# EAGLE design nixie-clock (EAGLE 9.1.0)
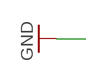
[diagram p0: schematic, sheet 1, part 1 of 2]
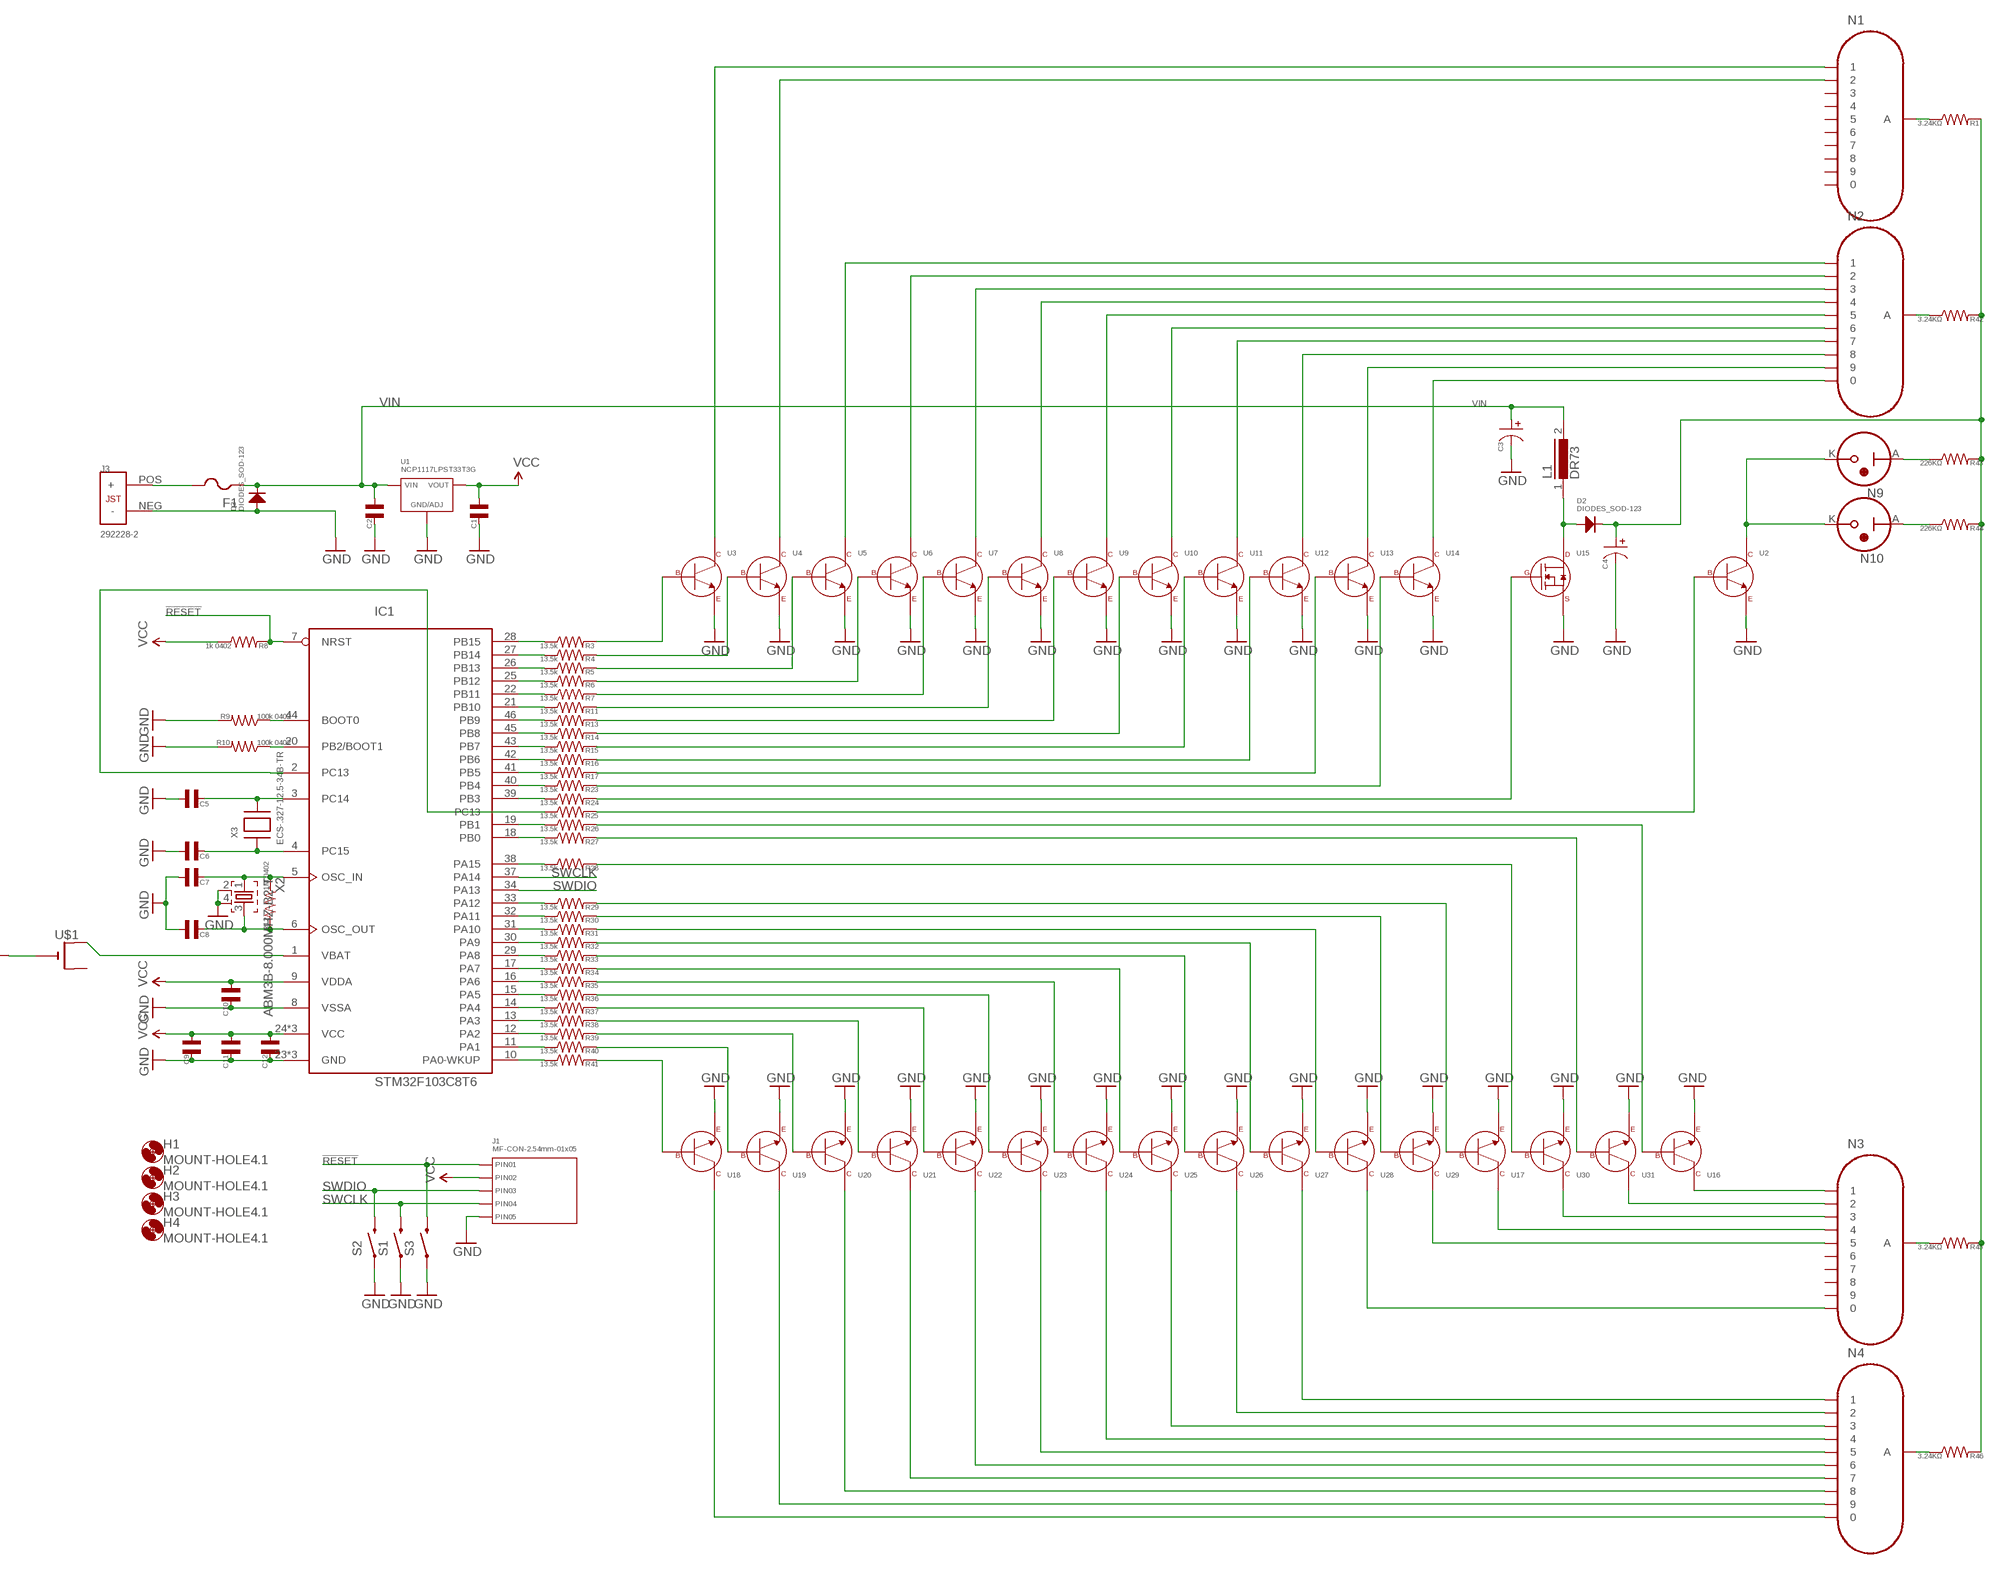
[diagram p1: schematic, sheet 1, part 2 of 2]

## Parts
C1  CAPACITOR_NP_1206  [C1206]
C2  CAPACITOR_NP_1206  [C1206]
C3  CAPACITOR_P_6.3MM  [CP6.3MM]
C4  CAPACITOR_P_6.3MM  [CP6.3MM]
C5  CAPACITOR_NP_0402  [C0402]
C6  CAPACITOR_NP_0402  [C0402]
C7  CAPACITOR_NP_0402  [C0402]
C8  CAPACITOR_NP_0402  [C0402]
C9  CAPACITOR_NP_0402  [C0402]
C10  CAPACITOR_NP_0402  [C0402]
C11  CAPACITOR_NP_0402  [C0402]
C12  CAPACITOR_NP_0402  [C0402]
D2  DIODES_SOD-123  [SOD-123]
D3  DIODES_SOD-123  [SOD-123]
F1  PTCFUSE-1812  [1812]
H1  MOUNT-HOLE4.1  [4,1]
H2  MOUNT-HOLE4.1  [4,1]
H3  MOUNT-HOLE4.1  [4,1]
H4  MOUNT-HOLE4.1  [4,1]
IC1  STM32F103C8T6  STM32F103C8T  [LQFP48]
J1  MF-CON-2.54mm-01x05  CON_01X05_PTH_2.54MM  [PTH_2.54MM_01X05]
J3  292228-2  MINICT  [292228-2]
L1  DR73  [DR73]
N1  Hour1  IN-4  [IN-4]
N2  Hour2  IN-4  [IN-4]
N3  Minutes1  IN-4  [IN-4]
N4  Minutes2  IN-4  [IN-4]
N9  RainyBulb  INS-1  [INS-1]
N10  SnowyBulb  INS-1  [INS-1]
R1  3.24KΩ  RESISTOR_0402  [R0402]
R3  13.5k  RESISTOR_0402  [R0402]
R4  13.5k  RESISTOR_0402  [R0402]
R5  13.5k  RESISTOR_0402  [R0402]
R6  13.5k  RESISTOR_0402  [R0402]
R7  13.5k  RESISTOR_0402  [R0402]
R8  1k 0402  RESISTOR_0402  [R0402]
R9  100k 0402  RESISTOR_0402  [R0402]
R10  100k 0402  RESISTOR_0402  [R0402]
R11  13.5k  RESISTOR_0402  [R0402]
R12  1M 0402  RESISTOR_0402  [R0402]
R13  13.5k  RESISTOR_0402  [R0402]
R14  13.5k  RESISTOR_0402  [R0402]
R15  13.5k  RESISTOR_0402  [R0402]
R16  13.5k  RESISTOR_0402  [R0402]
R17  13.5k  RESISTOR_0402  [R0402]
R23  13.5k  RESISTOR_0402  [R0402]
R24  13.5k  RESISTOR_0402  [R0402]
R25  13.5k  RESISTOR_0402  [R0402]
R26  13.5k  RESISTOR_0402  [R0402]
R27  13.5k  RESISTOR_0402  [R0402]
R28  13.5k  RESISTOR_0402  [R0402]
R29  13.5k  RESISTOR_0402  [R0402]
R30  13.5k  RESISTOR_0402  [R0402]
R31  13.5k  RESISTOR_0402  [R0402]
R32  13.5k  RESISTOR_0402  [R0402]
R33  13.5k  RESISTOR_0402  [R0402]
R34  13.5k  RESISTOR_0402  [R0402]
R35  13.5k  RESISTOR_0402  [R0402]
R36  13.5k  RESISTOR_0402  [R0402]
R37  13.5k  RESISTOR_0402  [R0402]
R38  13.5k  RESISTOR_0402  [R0402]
R39  13.5k  RESISTOR_0402  [R0402]
R40  13.5k  RESISTOR_0402  [R0402]
R41  13.5k  RESISTOR_0402  [R0402]
R42  3.24KΩ  RESISTOR_0402  [R0402]
R43  226KΩ  RESISTOR_0402  [R0402]
R44  226KΩ  RESISTOR_0402  [R0402]
R45  3.24KΩ  RESISTOR_0402  [R0402]
R46  3.24KΩ  RESISTOR_0402  [R0402]
S1  SWITCH-MOMENTARY-2TACTILE-SWITCH-SMD-RIGHT-ANGLE  [TACTILE_SWITCH-SMD-RIGHT-ANGLE]
S2  SWITCH-MOMENTARY-2TACTILE-SWITCH-SMD-RIGHT-ANGLE  [TACTILE_SWITCH-SMD-RIGHT-ANGLE]
S3  SWITCH-MOMENTARY-2TACTILE-SWITCH-SMD-RIGHT-ANGLE  [TACTILE_SWITCH-SMD-RIGHT-ANGLE]
U1  NCP1117LPST33T3G  [SOT-223-3]
U2  NPN_BJT_SOT-23-3  [SOT-23-3]
U3  NPN_BJT_SOT-23-3  [SOT-23-3]
U4  NPN_BJT_SOT-23-3  [SOT-23-3]
U5  NPN_BJT_SOT-23-3  [SOT-23-3]
U6  NPN_BJT_SOT-23-3  [SOT-23-3]
U7  NPN_BJT_SOT-23-3  [SOT-23-3]
U8  NPN_BJT_SOT-23-3  [SOT-23-3]
U9  NPN_BJT_SOT-23-3  [SOT-23-3]
U10  NPN_BJT_SOT-23-3  [SOT-23-3]
U11  NPN_BJT_SOT-23-3  [SOT-23-3]
U12  NPN_BJT_SOT-23-3  [SOT-23-3]
U13  NPN_BJT_SOT-23-3  [SOT-23-3]
U14  NPN_BJT_SOT-23-3  [SOT-23-3]
U15  N-CHANNEL_FET_TO-252-3  [TO-252-3]
U16  NPN_BJT_SOT-23-3  [SOT-23-3]
U17  NPN_BJT_SOT-23-3  [SOT-23-3]
U18  NPN_BJT_SOT-23-3  [SOT-23-3]
U19  NPN_BJT_SOT-23-3  [SOT-23-3]
U20  NPN_BJT_SOT-23-3  [SOT-23-3]
U21  NPN_BJT_SOT-23-3  [SOT-23-3]
U22  NPN_BJT_SOT-23-3  [SOT-23-3]
U23  NPN_BJT_SOT-23-3  [SOT-23-3]
U24  NPN_BJT_SOT-23-3  [SOT-23-3]
U25  NPN_BJT_SOT-23-3  [SOT-23-3]
U26  NPN_BJT_SOT-23-3  [SOT-23-3]
U27  NPN_BJT_SOT-23-3  [SOT-23-3]
U28  NPN_BJT_SOT-23-3  [SOT-23-3]
U29  NPN_BJT_SOT-23-3  [SOT-23-3]
U30  NPN_BJT_SOT-23-3  [SOT-23-3]
U31  NPN_BJT_SOT-23-3  [SOT-23-3]
U$1  CR1220SMT  [CR1220-SMD]
X2  ABM3B-8.000MHZ-B2-T  CRYSTALS-GND-LID-CFPX-104  [5.2X3.4-4-PAD]
X3  ECS-.327-12.5-34B-TR  XTAL-3.2X1.5  [XTAL3215]

## Nets
!RESET: IC1.7(NRST) J1.P$1(PIN1) R8.P$2 S3.2
GND [Power]: C1.P$2 C2.P$2 C3.P$2 C4.P$2 C5.P$1 C6.P$1 C7.P$1 C8.P$1 C9.P$2 C10.P$2 C11.P$2 C12.P$2 D3.ANODE IC1.8(VSSA) IC1.23(GND) IC1.35(GND) IC1.47(GND) J1.P$5(PIN5) J3.NEG(-) R9.P$2 R10.P$2 S1.1 S2.1 S3.1 U1.P$2(GND/ADJ) U2.P$2(EMITTER) U3.P$2(EMITTER) U4.P$2(EMITTER) U5.P$2(EMITTER) U6.P$2(EMITTER) U7.P$2(EMITTER) U8.P$2(EMITTER) U9.P$2(EMITTER) U10.P$2(EMITTER) U11.P$2(EMITTER) U12.P$2(EMITTER) U13.P$2(EMITTER) U14.P$2(EMITTER) U15.2(SOURCE) U16.P$2(EMITTER) U17.P$2(EMITTER) U18.P$2(EMITTER) U19.P$2(EMITTER) U20.P$2(EMITTER) U21.P$2(EMITTER) U22.P$2(EMITTER) U23.P$2(EMITTER) U24.P$2(EMITTER) U25.P$2(EMITTER) U26.P$2(EMITTER) U27.P$2(EMITTER) U28.P$2(EMITTER) U29.P$2(EMITTER) U30.P$2(EMITTER) U31.P$2(EMITTER) U$1.- X2.2 X2.4
HV [Power]: C4.P$1 D2.CATHODE R1.P$2 R42.P$2 R43.P$2 R44.P$2 R45.P$2 R46.P$2
HV1 [Power]: N1.4(A) R1.P$1
HV2 [Power]: N2.4(A) R42.P$1
HV3 [Power]: N3.4(A) R45.P$1
HV4 [Power]: N4.4(A) R46.P$1
N$1: IC1.28(PB15) R3.P$1
N$2: IC1.27(PB14) R4.P$1
N$3: IC1.26(PB13) R5.P$1
N$4: IC1.25(PB12) R6.P$1
N$5: IC1.22(PB11) R7.P$1
N$6: IC1.21(PB10) R11.P$1
N$7: IC1.46(PB9) R13.P$1
N$8: IC1.45(PB8) R14.P$1
N$9: IC1.43(PB7) R15.P$1
N$10: IC1.42(PB6) R16.P$1
N$11: IC1.41(PB5) R17.P$1
N$12: IC1.40(PB4) R23.P$1
N$13: IC1.39(PB3) R24.P$1
N$14: IC1.19(PB1) R26.P$1
N$15: IC1.18(PB0) R27.P$1
N$16: IC1.38(PA15) R28.P$1
N$17: IC1.33(PA12) R29.P$1
N$18: IC1.32(PA11) R30.P$1
N$19: IC1.31(PA10) R31.P$1
N$20: IC1.30(PA9) R32.P$1
N$21: IC1.29(PA8) R33.P$1
N$22: IC1.17(PA7) R34.P$1
N$23: IC1.16(PA6) R35.P$1
N$24: IC1.15(PA5) R36.P$1
N$25: IC1.14(PA4) R37.P$1
N$26: IC1.13(PA3) R38.P$1
N$27: IC1.12(PA2) R39.P$1
N$28: IC1.11(PA1) R40.P$1
N$29: IC1.10(PA0-WKUP) R41.P$1
N$30: R3.P$2 U3.P$1(BASE)
N$31: IC1.20(PB2/BOOT1) R10.P$1
N$32: IC1.44(BOOT0) R9.P$1
N$33: D2.ANODE L1.1 U15.PAD(DRAIN)
N$34: N9.A R43.P$1
N$35: N10.A R44.P$1
N$36: C5.P$2 IC1.3(PC14) X3.P$2
N$37: C6.P$2 IC1.4(PC15) X3.P$1
N$38: C7.P$2 IC1.5(OSC_IN) R12.P$1 X2.1
N$39: C8.P$2 IC1.6(OSC_OUT) R12.P$2 X2.3
N$42: R4.P$2 U4.P$1(BASE)
N$43: IC1.1(VBAT) U$1.+$1(+)
N$44: R5.P$2 U5.P$1(BASE)
N$45: R6.P$2 U6.P$1(BASE)
N$46: R7.P$2 U7.P$1(BASE)
N$47: R11.P$2 U8.P$1(BASE)
N$48: N1.14 U3.P$3(COLLECTOR)
N$49: N1.9 U4.P$3(COLLECTOR)
N$50: N2.14 U5.P$3(COLLECTOR)
N$51: N2.9 U6.P$3(COLLECTOR)
N$52: N2.11 U7.P$3(COLLECTOR)
N$53: N2.1 U8.P$3(COLLECTOR)
N$54: N2.12 U9.P$3(COLLECTOR)
N$55: N2.2 U10.P$3(COLLECTOR)
N$56: N2.6 U11.P$3(COLLECTOR)
N$57: R13.P$2 U9.P$1(BASE)
N$58: R14.P$2 U10.P$1(BASE)
N$59: R15.P$2 U11.P$1(BASE)
N$60: N2.3 U12.P$3(COLLECTOR)
N$61: N2.5 U13.P$3(COLLECTOR)
N$62: N2.8 U14.P$3(COLLECTOR)
N$63: R16.P$2 U12.P$1(BASE)
N$64: R17.P$2 U13.P$1(BASE)
N$65: R23.P$2 U14.P$1(BASE)
N$66: R24.P$2 U15.1(GATE)
N$67: R25.P$2 U2.P$1(BASE)
N$68: R26.P$2 U16.P$1(BASE)
N$69: F1.2 J3.POS(+)
N$70: N9.K N10.K U2.P$3(COLLECTOR)
N$71: N3.14 U16.P$3(COLLECTOR)
N$72: R41.P$2 U18.P$1(BASE)
N$73: R40.P$2 U19.P$1(BASE)
N$74: R39.P$2 U20.P$1(BASE)
N$75: R38.P$2 U21.P$1(BASE)
N$76: R37.P$2 U22.P$1(BASE)
N$77: R36.P$2 U23.P$1(BASE)
N$78: R35.P$2 U24.P$1(BASE)
N$79: R34.P$2 U25.P$1(BASE)
N$80: R33.P$2 U26.P$1(BASE)
N$81: R32.P$2 U27.P$1(BASE)
N$82: R31.P$2 U28.P$1(BASE)
N$83: R30.P$2 U29.P$1(BASE)
N$84: R29.P$2 U17.P$1(BASE)
N$85: R28.P$2 U30.P$1(BASE)
N$86: R27.P$2 U31.P$1(BASE)
N$87: N3.9 U31.P$3(COLLECTOR)
N$88: N3.11 U30.P$3(COLLECTOR)
N$89: N3.1 U17.P$3(COLLECTOR)
N$90: N3.12 U29.P$3(COLLECTOR)
N$91: N3.8 U28.P$3(COLLECTOR)
N$92: N4.14 U27.P$3(COLLECTOR)
N$93: N4.9 U26.P$3(COLLECTOR)
N$94: N4.11 U25.P$3(COLLECTOR)
N$95: N4.1 U24.P$3(COLLECTOR)
N$96: N4.12 U23.P$3(COLLECTOR)
N$97: N4.2 U22.P$3(COLLECTOR)
N$98: N4.6 U21.P$3(COLLECTOR)
N$99: N4.3 U20.P$3(COLLECTOR)
N$100: N4.5 U19.P$3(COLLECTOR)
N$101: N4.8 U18.P$3(COLLECTOR)
PC13: IC1.2(PC13) R25.P$1
SWCLK: IC1.37(PA14) J1.P$4(PIN4) S1.2
SWDIO: IC1.34(PA13) J1.P$3(PIN3) S2.2
VCC [Power]: C1.P$1 C9.P$1 C10.P$1 C11.P$1 C12.P$1 IC1.9(VDDA) IC1.24(VCC) IC1.36(VCC) IC1.48(VCC) J1.P$2(PIN2) R8.P$1 U1.P$1(VOUT) U1.P$3(VOUT)
VIN [thicc]: C2.P$1 C3.P$1 D3.CATHODE F1.1 L1.2 U1.P$4(VIN)
Unconnected: N1.1 N1.2 N1.3 N1.5 N1.6 N1.8 N1.11 N1.12 N3.2 N3.3 N3.5 N3.6 U$1.+$2(+1)

## Library data of the parts
C1 C2 C5-C12 = MF_Passives:CAPACITOR_NP: Library: MF_Passives Description: Device for Non-Polarized Capacitors. Manufacture part number (MPN) can be added via Attributes. Check https://factory.macrofab.com/parts for the house parts list.; POPULATE: 1
C3 C4 = MF_Passives:CAPACITOR_P: Library: MF_Passives Description: Device for Polarized Capacitors. Manufacture part number (MPN), Voltage Rating, and Tolerance can be added via Attributes. Check https://factory.macrofab.com/parts for the house parts list.; POPULATE: 1
D2 D3 = MF_Discrete_Semiconductor:DIODES: Library: MF_Discrete_Semiconductor Description: Device for Single Packaged Diodes.; HOUSEPART: NO; POPULATE: 1
F1 = adafruit:PTCFUSE: PTC fuses, resettable thermistors
H1-H4 = holes:MOUNT-HOLE: MOUNTING HOLE with drill center marker
IC1 = micro-stm_v2:STM32F103C*T: ARM 32-bit Cortex™-M3 CPU 72 MHz maximum frequency 16 to 128 Kbytes of Flash memory 6 to 20 kbytes of SRAM 37 GPIOs 2.0 to 3.6 V application supply
J1 = MF_Connectors:CON_01X05: Library: MF_Connectors Description: Header Connector with 5 Positions and 01 Rows. Use the LABEL Attribute to label the pin on the schematic and PCB. You can remove the attributes on the PCB by using the SMASH function on the part and then deleting the text.; HOUSEPART: YES; MPN: MF-CON-2.54mm-01x05; POPULATE: 1; URL: https://factory.macrofab.com/part/MF-CON-2.54mm-01x05
J3 = sonik:MINICT
L1 = inductors:DR73: High Power Density, High Efficiency, Shielded Inductors Source: coiltronics_dr_series.pdf; SPICEPREFIX: L
N1-N4 = russian-nixies:IN-4: IN-4: large numeric topview nixie tube
N9 N10 = russian-nixies:INS-1
R1 R3-R17 R23-R46 = MF_Passives:RESISTOR: Library: MF_Passives Description: Device for Resistors. Manufacture part number (MPN), Voltage, Tolerance, and Wattage Rating can be added via Attributes. Check https://factory.macrofab.com/parts for the house parts list.; POPULATE: 1
S1-S3 = sonik:SWITCH-MOMENTARY-2: Various NO switches- pushbuttons, reed, etc; PROD_ID: COMP-12265
U1 = MF_IC_Power:NCP1117LP: Manufacturer Part #: NCP1117LP Manufacturer: ON Semiconductor Description: LDO Voltage Regulators; HOUSEPART: NO; MPN: NCP1117LPST33T3G; POPULATE: 1; URL: http://www.onsemi.com/pub_link/Collateral/NCP1117LP-D.PDF
U2-U14 U16-U31 = MF_Discrete_Semiconductor:NPN_BJT: Library: MF_Discrete_Semiconductor Description: Device for Single NPN BJT Transistors. Manufacture part number (MFG#) can be added via Attributes.; HOUSEPART: NO; POPULATE: 1
U15 = MF_Discrete_Semiconductor:N-CHANNEL_FET: Library: MF_Discrete_Semiconductor Description: Device for Single N-Channel Mosfet. Manufacture part number (MFG#) can be added via Attributes.; HOUSEPART: NO; POPULATE: 1
U$1 = adafruit:CR1220: CR1216/CR1220/CR1225 12mm 3V lithium coin cell Great for battery packup. Both SMT and THM holders. Note the THM package has the ground pads on both sides of the PCB so that the masks are the same - this reduces the cost
X2 = IQD-Frequency-Products:CRYSTALS-GND-LID: CRYSTALS WITH CAN GROUNDED
X3 = adafruit:XTAL: Low cost SMT crystals, no capacitors included http://www.ladyada.net/library/eagle

## Net classes
1 Power: width 0.305 mm
2 thicc: width 0.61 mm

## Board
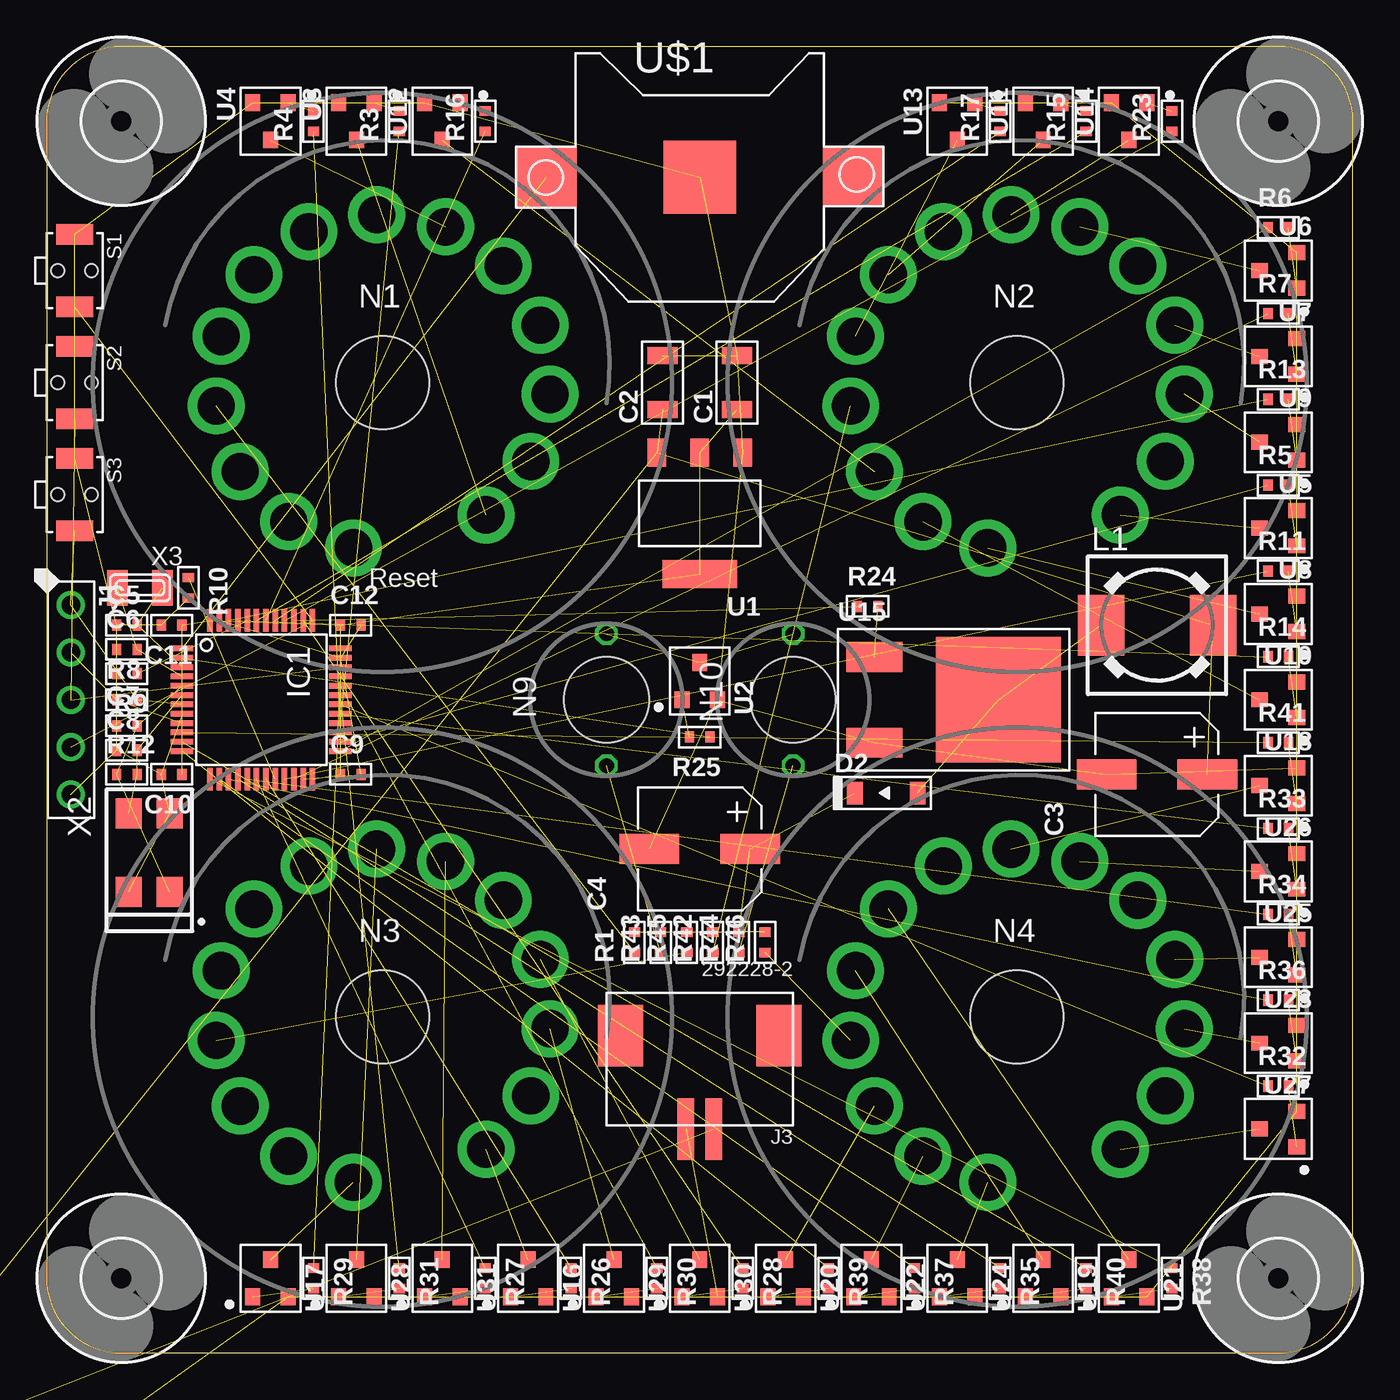
[diagram p2: board, top side]
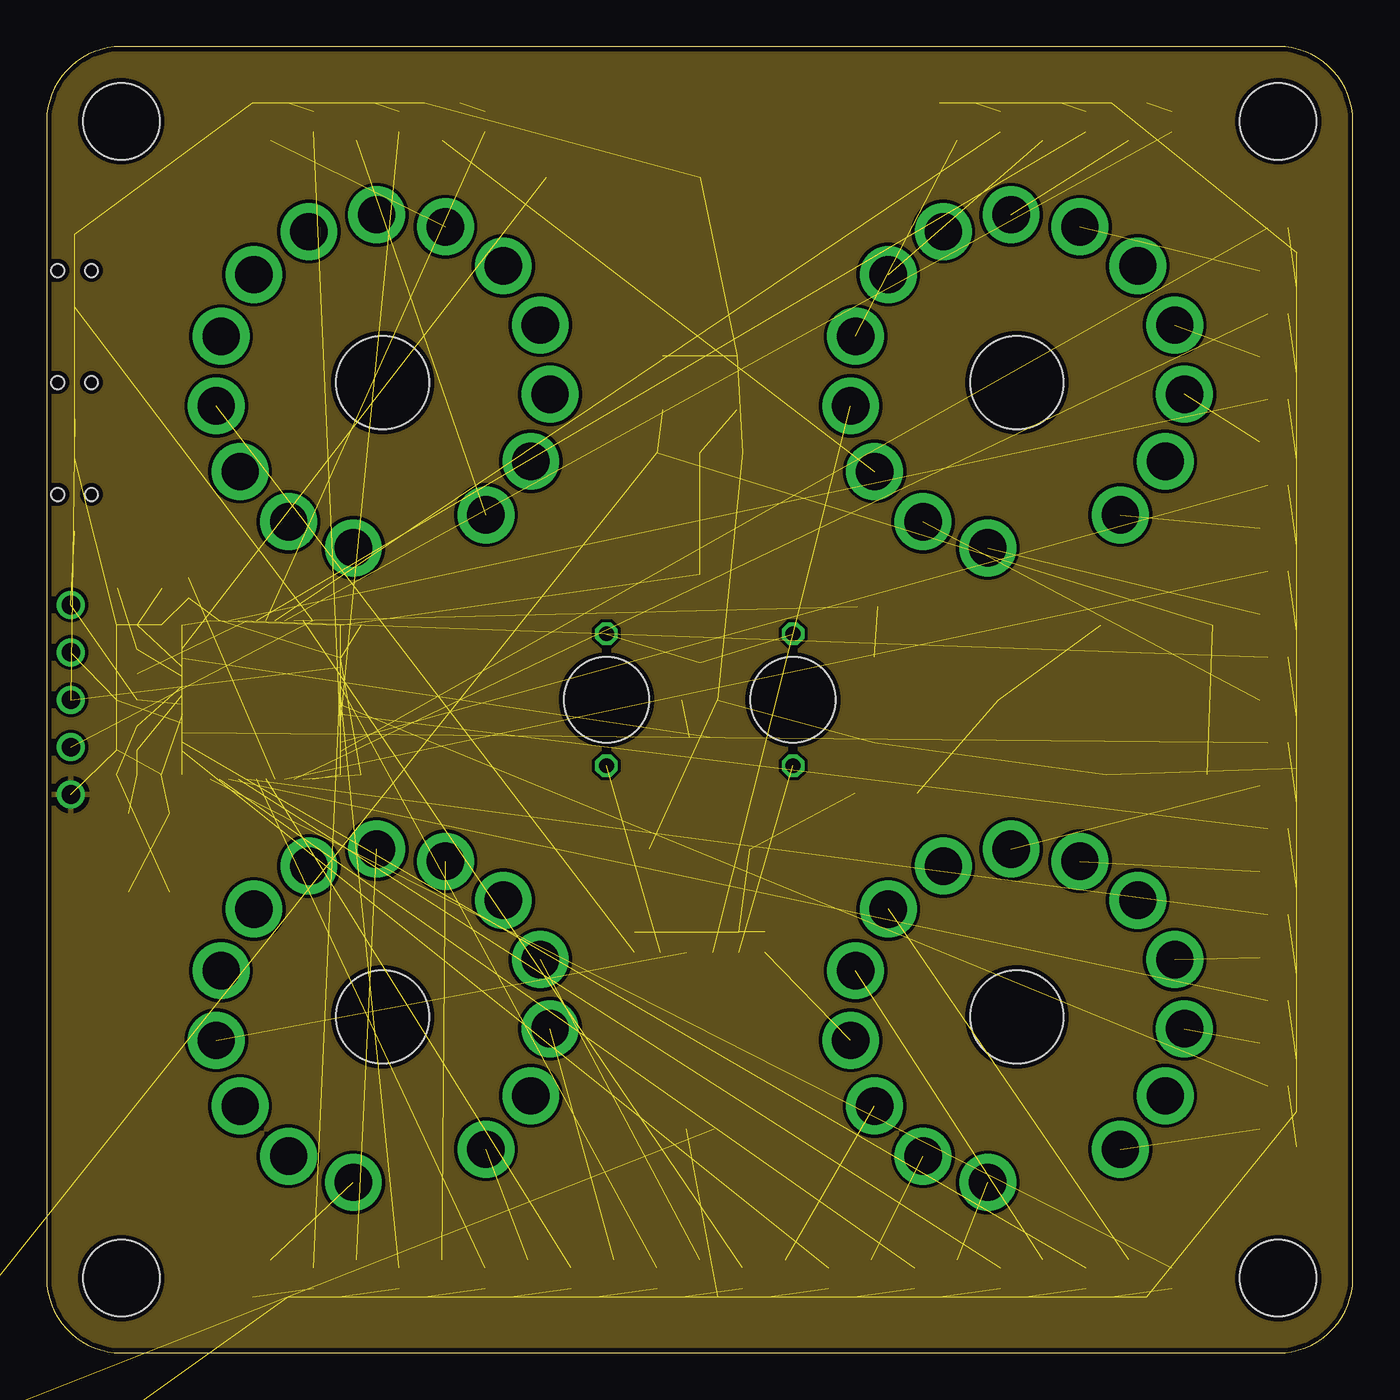
[diagram p3: board, inner layer Route2]
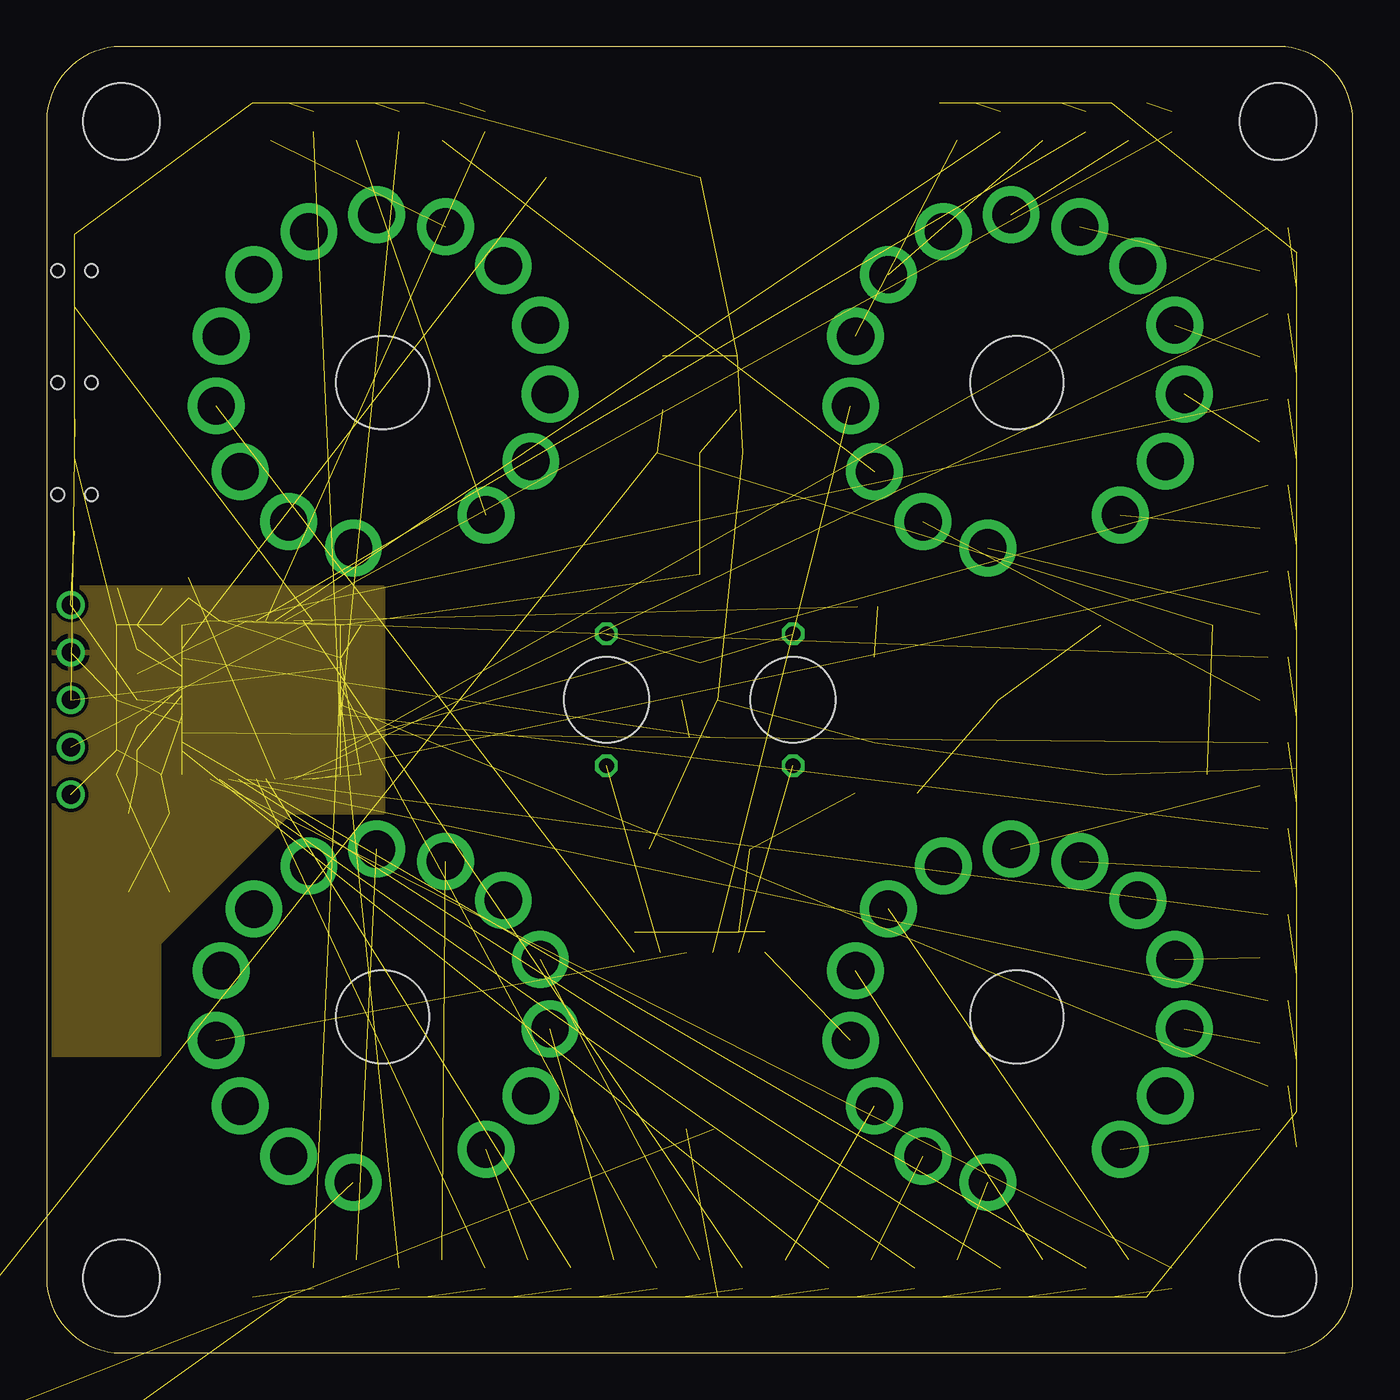
[diagram p4: board, inner layer Route15]

Size 70 x 70 mm. Coordinates in mm from the lower left corner, seen from the top.
Outline: 0,66 0,4 arc90 4,0 66,0 arc90 70,4 70,66 arc90 66,70 4,70 arc90 0,66
Copper layers (1*2*15*16): Top 0.035mm / dielectric 0.23mm / Route2 0.035mm / dielectric 0.93mm / Route15 0.035mm / dielectric 0.23mm / Bottom 0.035mm
Design rules "MF_Standard_4_Layer *": minimum track width 6mil, minimum drill 12mil, track to track 7mil, track to pad 7mil, pad to pad 7mil, via to via 7mil, smd to smd 0mil, copper to edge 10mil, drill to drill 10mil, minimum pad ring 6mil, minimum via ring 6mil, stop-mask expansion 2mil, vias tented up to drill 25mil, thermal gap 10mil

### Footprints (pad centres in the part's own frame; a part is rotated, then mirrored left to right if it is on the bottom)
C1206 = smd 0.9 x 1.6: P$1 -1.45,0; P$2 1.45,0
CP6.3MM = smd 1.6 x 3.2: P$1 0,-2.7; P$2 0,2.7
C0402 = smd 0.6 x 0.5: P$1 0,-0.55; P$2 0,0.55
SOD-123 = smd 0.85 x 1.2: ANODE 1.675,0; CATHODE -1.675,0
1812 = smd 2.286 x 2.794: 1 -2.046,0; 2 2.046,0
4,1 = hole 4.1: 0,0
LQFP48 = smd 0.3 x 1.2: 1 -2.75,-4.25; 2 -2.25,-4.25; 3 -1.75,-4.25; 4 -1.25,-4.25; 5 -0.75,-4.25; 6 -0.25,-4.25; 7 0.25,-4.25; 8 0.75,-4.25; 9 1.25,-4.25; 10 1.75,-4.25; 11 2.25,-4.25; 12 2.75,-4.25; 25 2.75,4.25; 26 2.25,4.25; 27 1.75,4.25; 28 1.25,4.25; 29 0.75,4.25; 30 0.25,4.25; 31 -0.25,4.25; 32 -0.75,4.25; 33 -1.25,4.25; 34 -1.75,4.25; 35 -2.25,4.25; 36 -2.75,4.25 | smd 1.2 x 0.3: 13 4.25,-2.75; 14 4.25,-2.25; 15 4.25,-1.75; 16 4.25,-1.25; 17 4.25,-0.75; 18 4.25,-0.25; 19 4.25,0.25; 20 4.25,0.75; 21 4.25,1.25; 22 4.25,1.75; 23 4.25,2.25; 24 4.25,2.75; 37 -4.25,2.75; 38 -4.25,2.25; 39 -4.25,1.75; 40 -4.25,1.25; 41 -4.25,0.75; 42 -4.25,0.25; 43 -4.25,-0.25; 44 -4.25,-0.75; 45 -4.25,-1.25; 46 -4.25,-1.75; 47 -4.25,-2.25; 48 -4.25,-2.75
PTH_2.54MM_01X05 = drill 1: P$1 -5.08,0; P$2 -2.54,0; P$3 0,0; P$4 2.54,0; P$5 5.08,0
292228-2 = smd 0.9 x 3.3: NEG 0.75,0; POS -0.75,0 | smd 2.4 x 3.3: SLD1 -4.25,-5; SLD2 4.25,-5
DR73 = smd 2.5 x 3.25: 1 -3,0; 2 3,0
IN-4 = drill 2 pad 3.048: 1 -1.563,-8.863; 2 -5.033,-7.461; 3 -7.632,-4.769; 4 -8.912,-1.253; 5 -8.651,2.481; 6 -6.894,5.785; 7 -3.945,8.089; 8 -0.314,8.995; 9 3.371,8.345; 10 6.474,6.252; 11 8.457,3.078; 12 8.978,-0.628; 13 7.947,-4.225; 14 5.541,-7.092 | hole 5: 0,0
INS-1 = drill 0.8 octagon: A -3.535,0; K 3.535,0 | hole 4.572: 0,0
R0402 = smd 0.5 x 0.6: P$1 -0.55,0; P$2 0.55,0
TACTILE_SWITCH-SMD-RIGHT-ANGLE = smd 1.1 x 2: 1 -1.95,0; 2 1.95,0 | hole 0.7: 0,0.9; 0,-0.9
SOT-223-3 = smd 1.5 x 4: P$1 3.25,0 | smd 1.5 x 1: P$2 -3.25,2.3; P$3 -3.25,0; P$4 -3.25,-2.3
SOT-23-3 = smd 0.9 x 0.8: P$1 -1,0.95; P$2 -1,-0.95; P$3 1,0
TO-252-3 = smd 3 x 1.6: 1 -6.65,2.3; 2 -6.65,-2.3 | smd 6.7 x 6.7: PAD 0,0
CR1220-SMD = smd 3.2 x 3.2: +$1 -8.2,0; +$2 8.2,0 | smd 3.9 x 3.9: - 0,0
5.2X3.4-4-PAD = smd 1.6 x 1.4: 1 -2.1,-1.1; 2 2.1,-1.1; 3 2.1,1.1; 4 -2.1,1.1
XTAL3215 = smd 1.1 x 1.9: P$1 1.2,0; P$2 -1.2,0

### Placement (x,y rotation side)
C1  37,52 90 top
C2  33,52 90 top
C3  59.5,31 90 top
C4  35,27 90 top
C5  4.3,39 270 top
C6  4.3,37.7 270 top
C7  4.3,33.6 270 top
C8  4.3,32.3 270 top
C9  16.3,31 270 top
C10  6.7,31 90 top
C11  6.7,39 90 top
C12  16.3,39 270 top
D2  45,30 0 top
D3  -7,-10 0 top  (outside the outline)
F1  -7,-4 0 top  (outside the outline)
H1  4,66 0 top
H2  66,66 0 top
H3  66,4 0 top
H4  4,4 0 top
IC1  11.5,35 270 top
J1  1.3,35 270 top
J3  35,12 180 top
L1  59.5,39 0 top
N1  18,52 0 top
N2  52,52 0 top
N3  18,18 0 top
N4  52,18 0 top
N9  30,35 90 top
N10  40,35 90 top
R1  31.5,22 90 top
R3  18.9,66 90 top
R4  14.3,66 90 top
R5  66,46.5 0 top
R6  66,60.3 0 top
R7  66,55.7 0 top
R8  4.3,35 0 top
R9  4.3,36.4 180 top
R10  7.6,41 270 top
R11  66,41.9 0 top
R12  4.3,31 0 top
R13  66,51.1 0 top
R14  66,37.3 0 top
R15  55.7,66 90 top
R16  23.5,66 90 top
R17  51.1,66 90 top
R23  60.3,66 90 top
R24  44,40 0 top
R25  35,33 180 top
R26  28.1,4 270 top
R27  23.5,4 270 top
R28  37.3,4 270 top
R29  14.3,4 270 top
R30  32.7,4 270 top
R31  18.9,4 270 top
R32  66,14.3 0 top
R33  66,28.1 0 top
R34  66,23.5 0 top
R35  51.1,4 270 top
R36  66,18.9 0 top
R37  46.5,4 270 top
R38  60.3,4 270 top
R39  41.9,4 270 top
R40  55.7,4 270 top
R41  66,32.7 0 top
R42  35.7,22 90 top
R43  32.9,22 90 top
R44  37.1,22 90 top
R45  34.3,22 90 top
R46  38.5,22 90 top
S1  1.5,58 270 top
S2  1.5,52 270 top
S3  1.5,46 270 top
U1  35,45 270 top
U2  35,36 90 top
U3  16.6,66 270 top
U4  12,66 270 top
U5  66,44.2 180 top
U6  66,58 180 top
U7  66,53.4 180 top
U8  66,39.6 180 top
U9  66,48.8 180 top
U10  66,35 180 top
U11  53.4,66 270 top
U12  21.2,66 270 top
U13  48.8,66 270 top
U14  58,66 270 top
U15  51,35 0 top
U16  25.8,4 90 top
U17  12,4 90 top
U18  66,30.4 180 top
U19  53.4,4 90 top
U20  39.6,4 90 top
U21  58,4 90 top
U22  44.2,4 90 top
U23  66,16.6 180 top
U24  48.8,4 90 top
U25  66,21.2 180 top
U26  66,25.8 180 top
U27  66,12 180 top
U28  16.6,4 90 top
U29  30.4,4 90 top
U30  35,4 90 top
U31  21.2,4 90 top
U$1  35,63 0 top
X2  5.5,26.8 90 top
X3  5,41 180 top

### Tracks (layer width: path | path; a pad name or v marks a point on that pad's centre or on a via)
!RESET  (3 unrouted)
GND  (57 unrouted)
  pour Route2 (isolate 0.13): 0,70 0,0 70,0 70,70
HV  (7 unrouted)
HV1  (1 unrouted)
HV2  (1 unrouted)
HV3  (1 unrouted)
HV4  (1 unrouted)
N$1  (1 unrouted)
N$2  (1 unrouted)
N$3  (1 unrouted)
N$4  (1 unrouted)
N$5  (1 unrouted)
N$6  (1 unrouted)
N$7  (1 unrouted)
N$8  (1 unrouted)
N$9  (1 unrouted)
N$10  (1 unrouted)
N$11  (1 unrouted)
N$12  (1 unrouted)
N$13  (1 unrouted)
N$14  (1 unrouted)
N$15  (1 unrouted)
N$16  (1 unrouted)
N$17  (1 unrouted)
N$18  (1 unrouted)
N$19  (1 unrouted)
N$20  (1 unrouted)
N$21  (1 unrouted)
N$22  (1 unrouted)
N$23  (1 unrouted)
N$24  (1 unrouted)
N$25  (1 unrouted)
N$26  (1 unrouted)
N$27  (1 unrouted)
N$28  (1 unrouted)
N$29  (1 unrouted)
N$30  (1 unrouted)
N$31  (1 unrouted)
N$32  (1 unrouted)
N$33  (2 unrouted)
N$34  (1 unrouted)
N$35  (1 unrouted)
N$36  (2 unrouted)
N$37  (2 unrouted)
N$38  (3 unrouted)
N$39  (3 unrouted)
N$42  (1 unrouted)
N$43  (1 unrouted)
N$44  (1 unrouted)
N$45  (1 unrouted)
N$46  (1 unrouted)
N$47  (1 unrouted)
N$48  (1 unrouted)
N$49  (1 unrouted)
N$50  (1 unrouted)
N$51  (1 unrouted)
N$52  (1 unrouted)
N$53  (1 unrouted)
N$54  (1 unrouted)
N$55  (1 unrouted)
N$56  (1 unrouted)
N$57  (1 unrouted)
N$58  (1 unrouted)
N$59  (1 unrouted)
N$60  (1 unrouted)
N$61  (1 unrouted)
N$62  (1 unrouted)
N$63  (1 unrouted)
N$64  (1 unrouted)
N$65  (1 unrouted)
N$66  (1 unrouted)
N$67  (1 unrouted)
N$68  (1 unrouted)
N$69  (1 unrouted)
N$70  (2 unrouted)
N$71  (1 unrouted)
N$72  (1 unrouted)
N$73  (1 unrouted)
N$74  (1 unrouted)
N$75  (1 unrouted)
N$76  (1 unrouted)
N$77  (1 unrouted)
N$78  (1 unrouted)
N$79  (1 unrouted)
N$80  (1 unrouted)
N$81  (1 unrouted)
N$82  (1 unrouted)
N$83  (1 unrouted)
N$84  (1 unrouted)
N$85  (1 unrouted)
N$86  (1 unrouted)
N$87  (1 unrouted)
N$88  (1 unrouted)
N$89  (1 unrouted)
N$90  (1 unrouted)
N$91  (1 unrouted)
N$92  (1 unrouted)
N$93  (1 unrouted)
N$94  (1 unrouted)
N$95  (1 unrouted)
N$96  (1 unrouted)
N$97  (1 unrouted)
N$98  (1 unrouted)
N$99  (1 unrouted)
N$100  (1 unrouted)
N$101  (1 unrouted)
PC13  (1 unrouted)
SWCLK  (2 unrouted)
SWDIO  (2 unrouted)
VCC  (12 unrouted)
  pour Route15 (isolate 0.13): 0,17 0,41 18,41 18,29 13,29 6,22 6,16 0,16
VIN  (5 unrouted)

### Text on the board
tNames: Reset